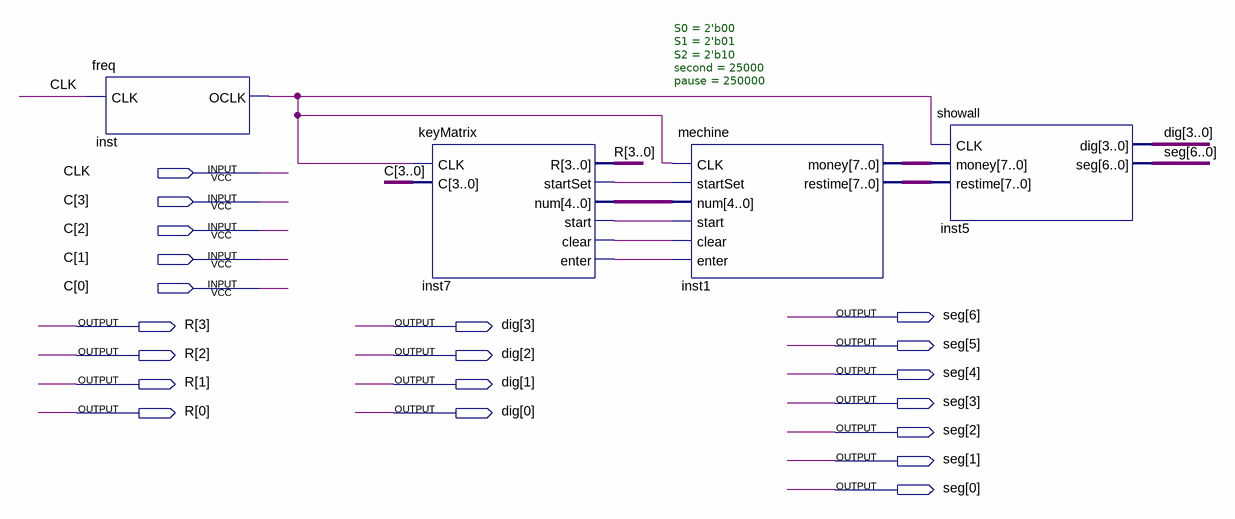
[diagram p0: schematic sheet]
// Quartus schematic main.bdf as structural Verilog: 4 symbols, 20 pins
module main (
  input  CLK,
  input  [3:0] C,
  output [6:0] seg,
  output [3:0] R,
  output [3:0] dig
);

  wire inst7_clear, inst7_enter, inst7_start, inst7_startset, inst_oclk;
  wire [4:0] inst7_num;
  wire [7:0] inst1_money, inst1_restime;

  freq inst (.CLK(CLK), .OCLK(inst_oclk));
  keyMatrix inst7 (
    .CLK(inst_oclk), .C(C), .R(R), .startSet(inst7_startset), .num(inst7_num), .start(inst7_start),
    .clear(inst7_clear), .enter(inst7_enter));
  mechine #(.S0(2'b00), .S1(2'b01), .S2(2'b10), .second(25000), .pause(250000)) inst1 (
    .CLK(inst_oclk), .startSet(inst7_startset), .num(inst7_num), .start(inst7_start), .clear(inst7_clear),
    .enter(inst7_enter), .money(inst1_money), .restime(inst1_restime));
  showall inst5 (.CLK(inst_oclk), .money(inst1_money), .restime(inst1_restime), .dig(dig), .seg(seg));
endmodule
